# Altium schematic sheet Sheet1.SchDoc
size A3
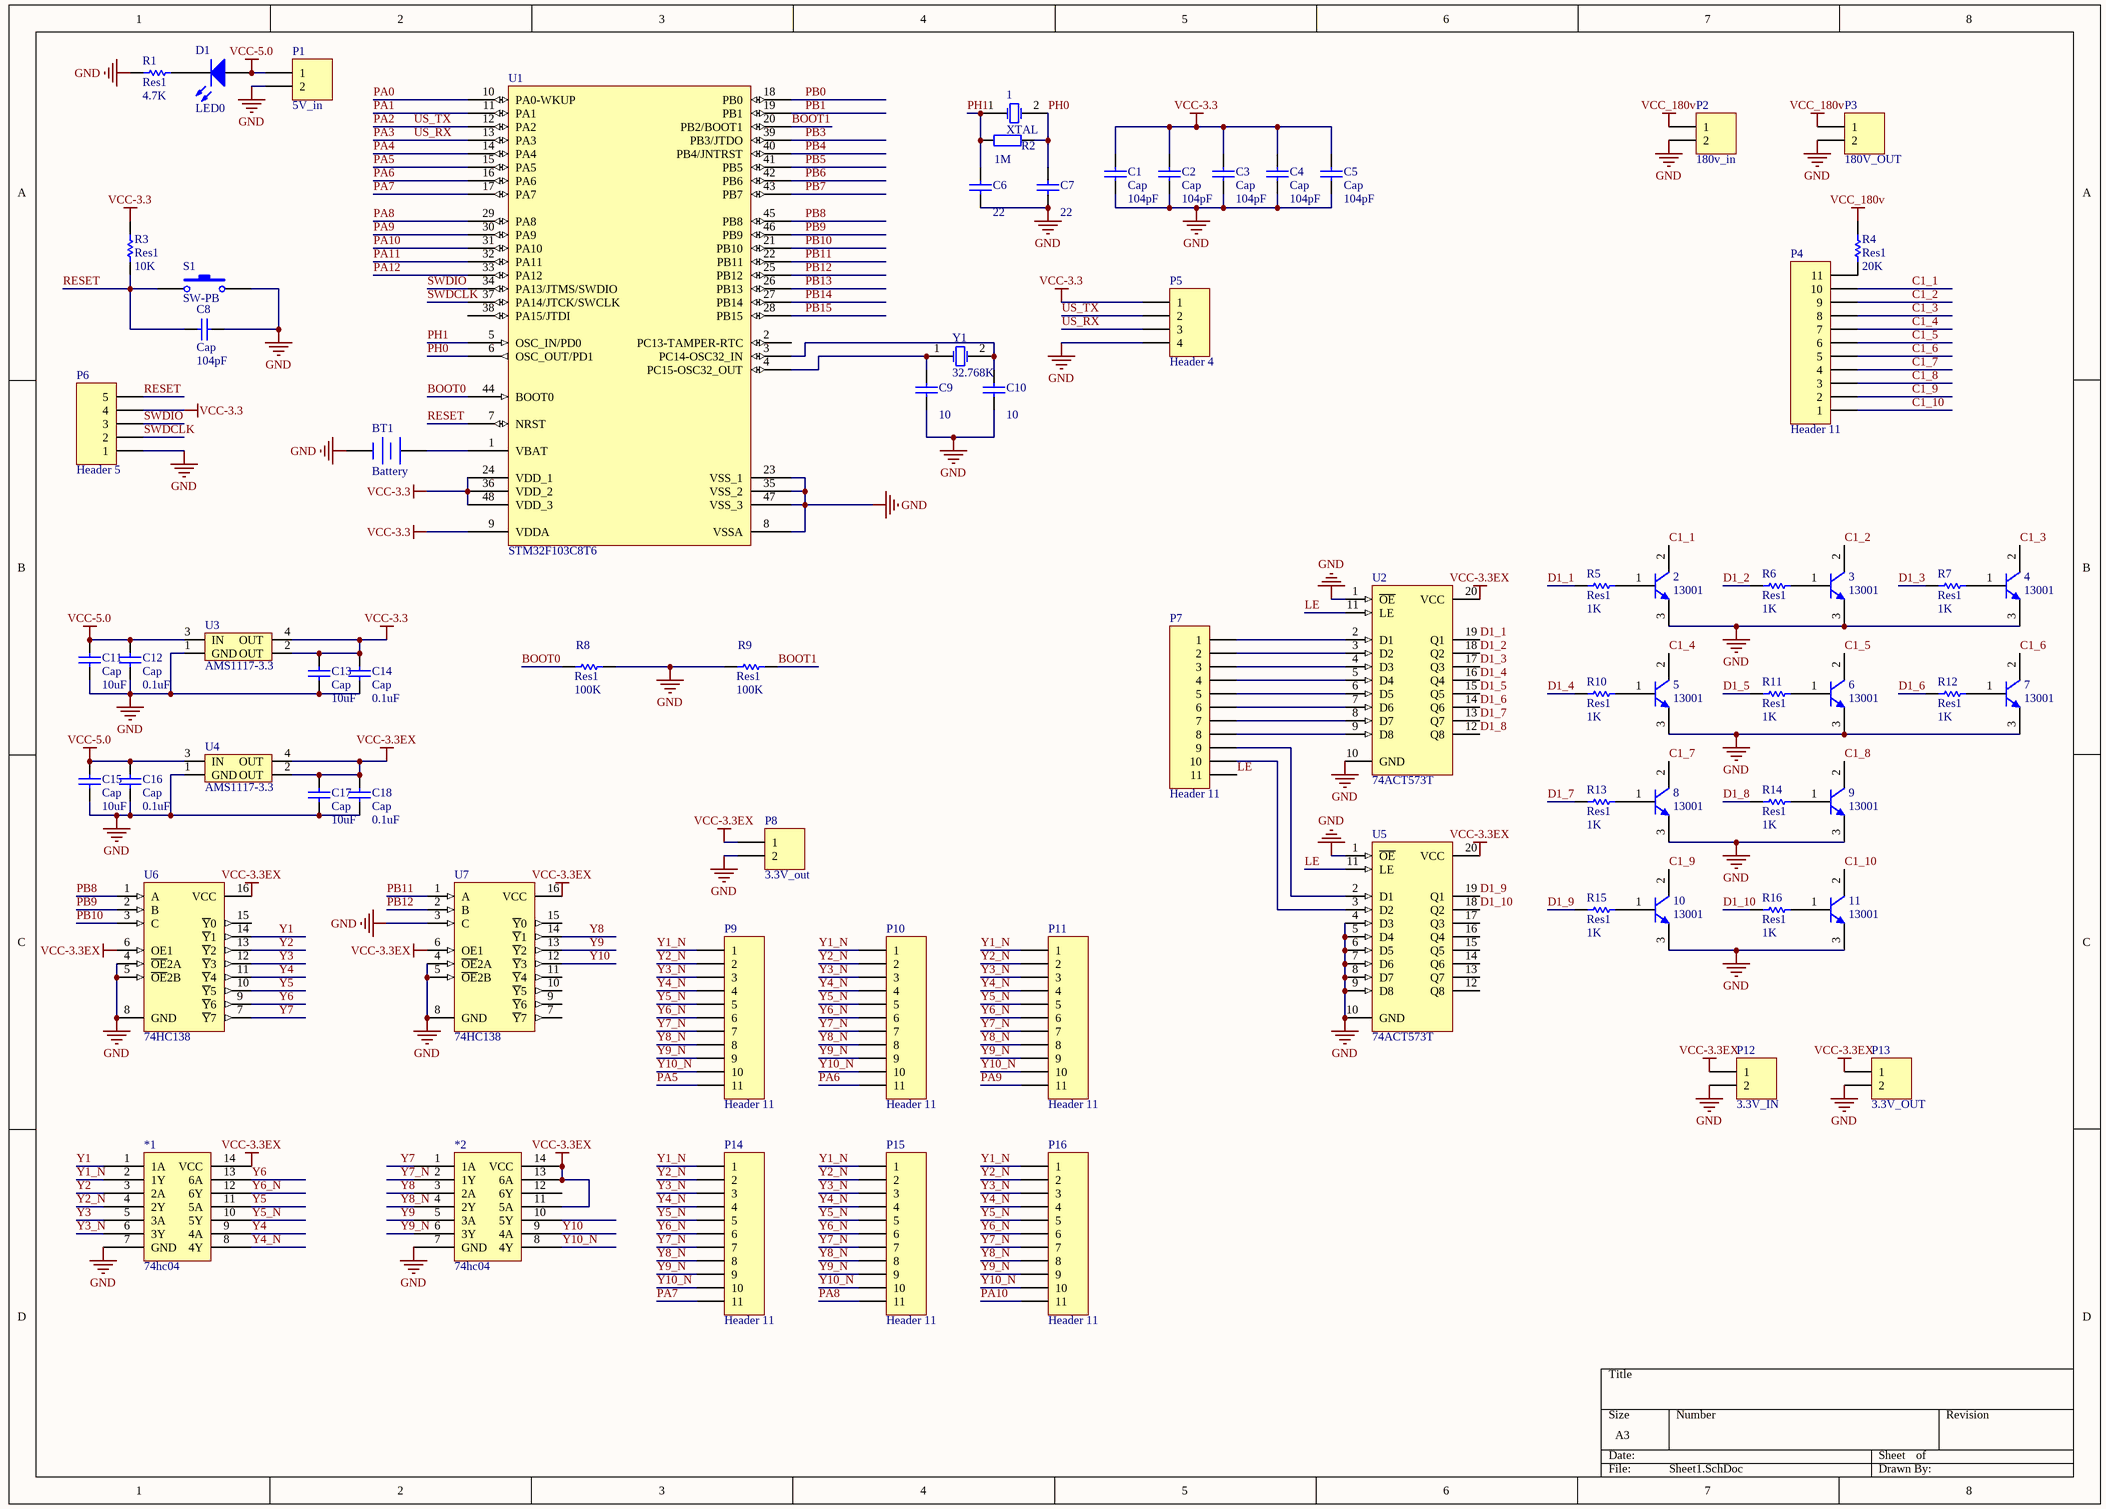
[diagram p0: Sheet1.SchDoc]

## Parts
1  XTAL  [49S-SMD]
2  13001  [TO-92A]
3  13001  [TO-92A]
4  13001  [TO-92A]
5  13001  [TO-92A]
6  13001  [TO-92A]
7  13001  [TO-92A]
8  13001  [TO-92A]
9  13001  [TO-92A]
10  13001  [TO-92A]
11  13001  [TO-92A]
*1  74hc04  [DIP-14]
*2  74hc04  [DIP-14]
BT1  Battery  [CR1220]
C1  Cap  value 104pF  [0603-1]
C2  Cap  value 104pF  [0603-1]
C3  Cap  value 104pF  [0603-1]
C4  Cap  value 104pF  [0603-1]
C5  Cap  value 104pF  [0603-1]
C6  value 22  [0603-1]
C7  value 22  [0603-1]
C8  Cap  value 104pF  [0603-1]
C9  value 10  [0603-1]
C10  value 10  [0603-1]
C11  Cap  value 10uF  [0603-1]
C12  Cap  value 0.1uF  [0603-1]
C13  Cap  value 10uF  [0603-1]
C14  Cap  value 0.1uF  [0603-1]
C15  Cap  value 10uF  [0603-1]
C16  Cap  value 0.1uF  [0603-1]
C17  Cap  value 10uF  [0603-1]
C18  Cap  value 0.1uF  [0603-1]
D1  LED0  [LED0805]
P1  5V_in  [XH2.54-2]
P2  180v_in  [XH2.54-2]
P3  180V_OUT  [XH2.54-2]
P4  Header 11  [SMT11P]
P5  Header 4  [HDR1X4]
P6  Header 5  [HDR1X5]
P7  Header 11  [SMT11P]
P8  3.3V_out  [XH2.54-2]
P9  Header 11  [SMT11P]
P10  Header 11  [SMT11P]
P11  Header 11  [SMT11P]
P12  3.3V_IN  [XH2.54-2]
P13  3.3V_OUT  [XH2.54-2]
P14  Header 11  [SMT11P]
P15  Header 11  [SMT11P]
P16  Header 11  [SMT11P]
R1  Res1  value 4.7K  [0603-1]
R2  value 1M  [0603-1]
R3  Res1  value 10K  [0603-1]
R4  Res1  value 20K  [0805-1R]
R5  Res1  value 1K  [0603R]
R6  Res1  value 1K  [0603R]
R7  Res1  value 1K  [0603R]
R8  Res1  value 100K  [0603-1]
R9  Res1  value 100K  [0603-1]
R10  Res1  value 1K  [0603R]
R11  Res1  value 1K  [0603R]
R12  Res1  value 1K  [0603R]
R13  Res1  value 1K  [0603R]
R14  Res1  value 1K  [0603R]
R15  Res1  value 1K  [0603R]
R16  Res1  value 1K  [0603R]
S1  SW-PB  [KEY-SMD1]
U1  STM32F103C8T6  [LQFP48_N]
U2  74ACT573T  [DIP-20]
U3  AMS1117-3.3  [AMS1117]
U4  AMS1117-3.3  [AMS1117]
U5  74ACT573T  [DIP-20]
U6  74HC138  [DIP-16]
U7  74HC138  [DIP-16]
Y1  32.768K  [XTAL32]

## Nets
GND: 2.3(E) 3.3(E) 4.3(E) 5.3(E) 6.3(E) 7.3(E) 8.3(E) 9.3(E) 10.3(E) 11.3(E) *1.7(GND) *2.7(GND) BT1.2(-) C1.2 C2.2 C3.2 C4.2 C5.2 C6.1 C7.2 C8.1 C9.1 C10.2 C11.1 C12.1 C13.1 C14.1 C15.1 C16.1 C17.1 C18.1 P1.2 P2.2 P3.2 P5.4 P6.1 P8.2 P12.2 P13.2 R1.1 R8.2 R9.1 S1.2 U1.8(VSSA) U1.23(VSS_1) U1.35(VSS_2) U1.47(VSS_3) U2.1(~{OE}) U2.10(GND) U3.1(GND) U4.1(GND) U5.1(~{OE}) U5.4(D3) U5.5(D4) U5.6(D5) U5.7(D6) U5.8(D7) U5.9(D8) U5.10(GND) U6.4(~{OE}2A) U6.5(~{OE}2B) U6.8(GND) U7.3(C) U7.4(~{OE}2A) U7.5(~{OE}2B) U7.8(GND)
VCC-3.3: C1.1 C2.1 C3.1 C4.1 C5.1 C13.2 C14.2 P5.1 P6.4 R3.2 U1.9(VDDA) U1.24(VDD_1) U1.36(VDD_2) U1.48(VDD_3) U3.2(OUT) U3.4(OUT)
VCC-3.3EX: *1.14(VCC) *2.11(5A) *2.13(6A) *2.14(VCC) C17.2 C18.2 P8.1 P12.1 P13.1 U2.20(VCC) U4.2(OUT) U4.4(OUT) U5.20(VCC) U6.6(OE1) U6.16(VCC) U7.6(OE1) U7.16(VCC)
VCC-5.0: C11.2 C12.2 C15.2 C16.2 D1.1(A) P1.1 U3.3(IN) U4.3(IN)
VCC_180v: P2.1 P3.1 R4.2
BOOT0: R8.1 U1.44(BOOT0)
BOOT1: R9.2 U1.20(PB2/BOOT1)
C1_1: 2.2(C) P4.10
C1_2: 3.2(C) P4.9
C1_3: 4.2(C) P4.8
C1_4: 5.2(C) P4.7
C1_5: 6.2(C) P4.6
C1_6: 7.2(C) P4.5
C1_7: 8.2(C) P4.4
C1_8: 9.2(C) P4.3
C1_9: 10.2(C) P4.2
C1_10: 11.2(C) P4.1
D1_1: R5.1 U2.19(Q1)
D1_2: R6.1 U2.18(Q2)
D1_3: R7.1 U2.17(Q3)
D1_4: R10.1 U2.16(Q4)
D1_5: R11.1 U2.15(Q5)
D1_6: R12.1 U2.14(Q6)
D1_7: R13.1 U2.13(Q7)
D1_8: R14.1 U2.12(Q8)
D1_9: R15.1 U5.19(Q1)
D1_10: R16.1 U5.18(Q2)
LE: P7.11 U2.11(LE) U5.11(LE)
PA0: U1.10(PA0-WKUP)
PA1: U1.11(PA1)
PA2: P5.2 U1.12(PA2)  [also labelled US_TX]
PA3: P5.3 U1.13(PA3)  [also labelled US_RX]
PA4: U1.14(PA4)
PA5: P9.11 U1.15(PA5)
PA6: P10.11 U1.16(PA6)
PA7: P14.11 U1.17(PA7)
PA8: P15.11 U1.29(PA8)
PA9: P11.11 U1.30(PA9)
PA10: P16.11 U1.31(PA10)
PA11: U1.32(PA11)
PA12: U1.33(PA12)
PB0: U1.18(PB0)
PB1: U1.19(PB1)
PB3: U1.39(PB3/JTDO)
PB4: U1.40(PB4/JNTRST)
PB5: U1.41(PB5)
PB6: U1.42(PB6)
PB7: U1.43(PB7)
PB8: U1.45(PB8) U6.1(A)
PB9: U1.46(PB9) U6.2(B)
PB10: U1.21(PB10) U6.3(C)
PB11: U1.22(PB11) U7.1(A)
PB12: U1.25(PB12) U7.2(B)
PB13: U1.26(PB13)
PB14: U1.27(PB14)
PB15: U1.28(PB15)
PH0: 1.2(OSC2) C7.1 R2.1 U1.6(OSC_OUT/PD1)
PH1: 1.1(OSC1) C6.2 R2.2 U1.5(OSC_IN/PD0)
RESET: C8.2 P6.5 R3.1 S1.1 U1.7(NRST)
SWDCLK: P6.2 U1.37(PA14/JTCK/SWCLK)
SWDIO: P6.3 U1.34(PA13/JTMS/SWDIO)
Y1: *1.1(1A) U6.14(~{Y}1)
Y1_N: *1.2(1Y) P9.1 P10.1 P11.1 P14.1 P15.1 P16.1
Y2: *1.3(2A) U6.13(~{Y}2)
Y2_N: *1.4(2Y) P9.2 P10.2 P11.2 P14.2 P15.2 P16.2
Y3: *1.5(3A) U6.12(~{Y}3)
Y3_N: *1.6(3Y) P9.3 P10.3 P11.3 P14.3 P15.3 P16.3
Y4: *1.9(4A) U6.11(~{Y}4)
Y4_N: *1.8(4Y) P9.4 P10.4 P11.4 P14.4 P15.4 P16.4
Y5: *1.11(5A) U6.10(~{Y}5)
Y5_N: *1.10(5Y) P9.5 P10.5 P11.5 P14.5 P15.5 P16.5
Y6: *1.13(6A) U6.9(~{Y}6)
Y6_N: *1.12(6Y) P9.6 P10.6 P11.6 P14.6 P15.6 P16.6
Y7: *2.1(1A) U6.7(~{Y}7)
Y7_N: *2.2(1Y) P9.7 P10.7 P11.7 P14.7 P15.7 P16.7
Y8: *2.3(2A) U7.14(~{Y}1)
Y8_N: *2.4(2Y) P9.8 P10.8 P11.8 P14.8 P15.8 P16.8
Y9: *2.5(3A) U7.13(~{Y}2)
Y9_N: *2.6(3Y) P9.9 P10.9 P11.9 P14.9 P15.9 P16.9
Y10: *2.9(4A) U7.12(~{Y}3)
Y10_N: *2.8(4Y) P9.10 P10.10 P11.10 P14.10 P15.10 P16.10
Net2_1: 2.1(B) R5.2
Net3_1: 3.1(B) R6.2
Net4_1: 4.1(B) R7.2
Net5_1: 5.1(B) R10.2
Net6_1: 6.1(B) R11.2
Net7_1: 7.1(B) R12.2
Net8_1: 8.1(B) R13.2
Net9_1: 9.1(B) R14.2
Net10_1: 10.1(B) R15.2
Net11_1: 11.1(B) R16.2
NetBT1_1: BT1.1(+) U1.1(VBAT)
NetC9_2: C9.2 U1.4(PC15-OSC32_OUT) Y1.1(OSC1)
NetC10_1: C10.1 U1.3(PC14-OSC32_IN) Y1.2(OSC2)
NetD1_2: D1.2(K) R1.2
NetP4_11: P4.11 R4.1
NetP7_1: P7.1 U2.2(D1)
NetP7_2: P7.2 U2.3(D2)
NetP7_3: P7.3 U2.4(D3)
NetP7_4: P7.4 U2.5(D4)
NetP7_5: P7.5 U2.6(D5)
NetP7_6: P7.6 U2.7(D6)
NetP7_7: P7.7 U2.8(D7)
NetP7_8: P7.8 U2.9(D8)
NetP7_9: P7.9 U5.2(D1)
NetP7_10: P7.10 U5.3(D2)

Not connected (* = marked no-connect by the designer): *2 10(5Y) 12(6Y); U1 2(PC13-TAMPER-RTC) 38(PA15/JTDI); U5 12(Q8) 13(Q7) 14(Q6) 15(Q5) 16(Q4) 17(Q3); U6 15(~{Y}0); U7 7(~{Y}7) 9(~{Y}6) 10(~{Y}5) 11(~{Y}4) 15(~{Y}0)

## Library data of the parts
1 = XTAL: Crystal Oscillator; Published: 8-Jun-2000; LatestRevisionDate: 17-Jul-2002; LatestRevisionNote: Re-released for DXP Platform.; PackageReference: R38; Publisher: Altium Limited; PackageDescription: Crystal, Thru-Hole; 2 Leads; Body 3.1 x 8.2 mm (Dia.xH)
2-11 = 13001: NPN三极管; Published: 8-Jun-2000; LatestRevisionDate: 15-Jan-2003; LatestRevisionNote: PCB Footprint 'BCY-W3/D4.7' replaced; DatasheetDocument: 1997; PackageDocument: Sep-1998; PackageReference: TO-92A; Publisher: Altium Limited; Code_JEDEC: TO-92A; ComponentLink1Description: Manufacturer Link; ComponentLink1URL: http://www.fairchildsemi.com/; ComponentLink2Description: Datasheet; ComponentLink2URL: http://www.fairchildsemi.com/ds/2N%2F2N3904.pdf
*1 *2 = 74hc04: 非门
BT1 = Battery: 备份电池; Published: 24-Mar-1999; LatestRevisionDate: 17-Jul-2002; LatestRevisionNote: Re-released for DXP Platform.; PackageReference: BAT-2; Publisher: Altium Limited
C1-C18 = Cap: Capacitor; Published: 8-Jun-2000; LatestRevisionDate: 17-Jul-2002; LatestRevisionNote: Re-released for DXP Platform.; PackageReference: RAD-0.3; Publisher: Altium Limited; PackageDescription: Radial Cap, Thru-Hole; 2 Leads; 0.3 in Pin Spacing
D1 = LED0: Typical INFRARED GaAs LED; Published: 8-Jun-2000; LatestRevisionDate: 08-Jul-2005; LatestRevisionNote: Mech Layer 1 removed.; PackageReference: LED-0; Publisher: Altium Limited; PackageDescription: LED; 2 Leads
P1-P3 P8 P12 P13 = Header 2: Header, 2-Pin; LatestRevisionDate: 17-Jul-2002; LatestRevisionNote: Re-released for DXP Platform.; Publisher: Altium Limited
P4 P7 P9-P11 P14-P16 = Header 11: Header, 11-Pin; LatestRevisionDate: 17-Jul-2002; LatestRevisionNote: Re-released for DXP Platform.; Publisher: Altium Limited
P5 = Header 4: Header, 4-Pin; LatestRevisionDate: 17-Jul-2002; LatestRevisionNote: Re-released for DXP Platform.; Publisher: Altium Limited
P6 = Header 5: Header, 5-Pin; LatestRevisionDate: 17-Jul-2002; LatestRevisionNote: Re-released for DXP Platform.; Publisher: Altium Limited
R1 R3-R16 = Res1: Resistor; Published: 8-Jun-2000; LatestRevisionDate: 17-Jul-2002; LatestRevisionNote: Re-released for DXP Platform.; PackageReference: AXIAL-0.3; Publisher: Altium Limited; PackageDescription: Axial Device, Thru-Hole; 2 Leads; 0.3 in Pin Spacing
R2 = Res2: Resistor; Published: 8-Jun-2000; LatestRevisionDate: 17-Jul-2002; LatestRevisionNote: Re-released for DXP Platform.; PackageReference: AXIAL-0.4; Publisher: Altium Limited; PackageDescription: Axial Device, Thru-Hole; 2 Leads; 0.4 in Pin Spacing
S1 = SW-PB: Switch; Published: 24-Mar-1999; LatestRevisionDate: 17-Jul-2002; LatestRevisionNote: Re-released for DXP Platform.; PackageReference: SPST-2; Publisher: Altium Limited; PackageDescription: Switch; 2 Leads
U1 = STM32F103C8T6: STM32 ARM-based 32-bit MCU with 64 Kbytes Flash, 48-pin LQFP, Industrial Temperature; Published: 30-May-2008; DatasheetVersion: rev6, Mar-2008; PackageVersion: Mar-2008; PackageReference: LQFP48; Publisher: Altium Limited; PackageDescription: 48-Pin Low-Profile Quad Flat Pack, 7 x 7 mm Body, 0.5 mm Pitch (LQFP48); ComponentLink1Description: Manufacturer Link; ComponentLink1URL: www.st.com/stm32; ComponentLink2Description: Datasheet; ComponentLink2URL: http://www.st.com/stonline/products/literature/ds/13587.pdf
U2 U5 = 74ACT573T: 双向数据传输; Published: 8-Jun-2000; LatestRevisionDate: 06-Jun-2005; LatestRevisionNote: Stylized 3D Model Added.; DatasheetVersion: May-1999; PackageReference: TSSOP20; Publisher: Altium Limited; PackageDescription: Shrink Small Outline; 20 Leads; Body Width 4.4 mm; Pitch 0.65 mm; ComponentLink1Description: Manufacturer Link; ComponentLink1URL: http://www.st.com/; ComponentLink2Description: Datasheet; ComponentLink2URL: http://www.st.com/stonline/products/literature/ds/4820/74act573.pdf
U3 U4 = AMS1117
U6 U7 = 74HC138: 138译码器; Published: 17-Jul-2002; LatestRevisionDate: 13-Apr-2006; LatestRevisionNote: IPC-7351 Footprint Added.; DatasheetVersion: Nov-1999; PackageVersion: 2000; PackageReference: M16D; Publisher: Altium Limited; PackageDescription: 16-Pin Small Outline Package 1.27 mm Pitch; ComponentLink1Description: Manufacturer Link; ComponentLink1URL: http://www.fairchildsemi.com/; ComponentLink2Description: Datasheet; ComponentLink2URL: http://www.fairchildsemi.com/ds/74%2F74AC138.pdf
Y1 = XTAL_1: Crystal Oscillator; Published: 8-Jun-2000; LatestRevisionDate: 17-Jul-2002; LatestRevisionNote: Re-released for DXP Platform.; Publisher: Altium Limited